# Altium schematic sheet top.SchDoc
size A4; SheetNumber: 1; SheetTotal: 3
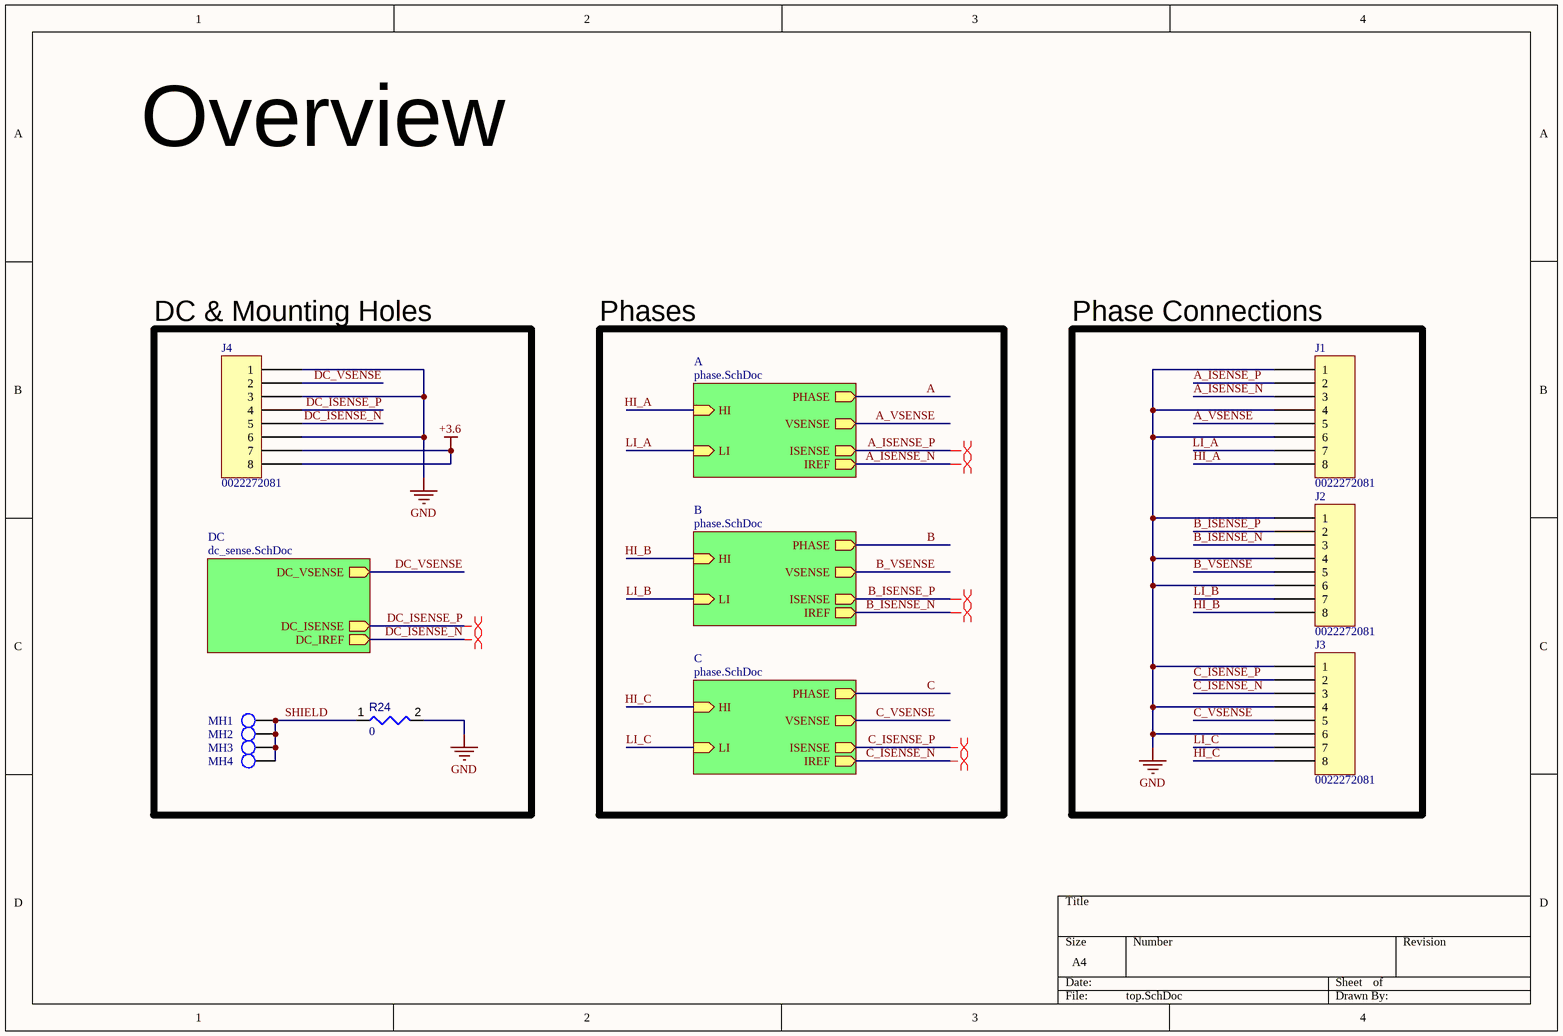
[diagram p0: top.SchDoc]

## Parts
J1  0022272081  [MOLEX KK 0022272081]
J2  0022272081  [MOLEX KK 0022272081]
J3  0022272081  [MOLEX KK 0022272081]
J4  0022272081  [MOLEX KK 0022272081]
MH1  Mounting Hole M2.5-Plated  [Copy of Mounting Hole 6-32-Footprint-1]  (value not drawn)
MH2  Mounting Hole M2.5-Plated  [Copy of Mounting Hole 6-32-Footprint-1]  (value not drawn)
MH3  Mounting Hole M2.5-Plated  [Copy of Mounting Hole 6-32-Footprint-1]  (value not drawn)
MH4  Mounting Hole M2.5-Plated  [Copy of Mounting Hole 6-32-Footprint-1]  (value not drawn)
R24  value 0  [RESC0603(1608)_L]  (hidden comment: 0R3J)

## Blocks framed on the sheet
DC & Mounting Holes: J4 MH1-MH4 R24
Phase Connections: J1-J3

## Sub-sheets
A = phase.SchDoc: HI (in), LI (in), PHASE (out), VSENSE (out), ISENSE (out), IREF (out)
B = phase.SchDoc: HI (in), LI (in), PHASE (out), VSENSE (out), ISENSE (out), IREF (out)
C = phase.SchDoc: HI (in), LI (in), PHASE (out), VSENSE (out), ISENSE (out), IREF (out)
DC = dc_sense.SchDoc: DC_VSENSE (out), DC_ISENSE (out), DC_IREF (out)

## Nets
+3.6: J4.7 J4.8
GND: J1.1 J1.4 J1.6 J2.1 J2.4 J2.6 J3.1 J3.4 J3.6 J4.1 J4.3 J4.6 R24.2
A: sheet A/PHASE
A_ISENSE_N: J1.3 ; sheet A/IREF
A_ISENSE_P: J1.2 ; sheet A/ISENSE
A_VSENSE: J1.5 ; sheet A/VSENSE
B: sheet B/PHASE
B_ISENSE_N: J2.3 ; sheet B/IREF
B_ISENSE_P: J2.2 ; sheet B/ISENSE
B_VSENSE: J2.5 ; sheet B/VSENSE
C: sheet C/PHASE
C_ISENSE_N: J3.3 ; sheet C/IREF
C_ISENSE_P: J3.2 ; sheet C/ISENSE
C_VSENSE: J3.5 ; sheet C/VSENSE
DC_ISENSE_N: J4.5 ; sheet DC/DC_IREF
DC_ISENSE_P: J4.4 ; sheet DC/DC_ISENSE
DC_VSENSE: J4.2 ; sheet DC/DC_VSENSE
HI_A: J1.8 ; sheet A/HI
HI_B: J2.8 ; sheet B/HI
HI_C: J3.8 ; sheet C/HI
LI_A: J1.7 ; sheet A/LI
LI_B: J2.7 ; sheet B/LI
LI_C: J3.7 ; sheet C/LI
SHIELD: MH1.1 MH2.1 MH3.1 MH4.1 R24.1

## Layout directives
differential pair: A_ISENSE_N, A_ISENSE_P, B_ISENSE_N, B_ISENSE_P, C_ISENSE_N, C_ISENSE_P, DC_ISENSE_N, DC_ISENSE_P

## Notes on the sheet
- Overview
- Phases

## Library data of the parts
J1-J4 = CMP-002-00675-1: CONN HEADER VERT 8POS 2.54MM; Manufacturer: Molex; Contact Length - Mating: 0.295" (7.49mm); Contact Length - Post: 0.140" (3.56mm); Shrouding: Shrouded - 1 Wall; Style: Board to Cable/Wire; Number of Positions Loaded: All; Number of Positions: 8; Pitch - Mating: 0.100" (2.54mm); Overall Contact Length: 0.560" (14.22mm); Material Flammability Rating: UL94 V-0; Insulation Height: 0.461" (11.70mm); LastUpdated: 1/12/2020 11:52:41 PM; Connector Type: Header; ComponentLink2Description: DigiKey Link; ComponentLink2URL: http://digikey.com/product-detail/en/molex/0022272081/WM4117-ND/1130583; Part Number: 0022272081; Part Status: Active; ComponentLink1Description: Datasheet; Lifecycle Status: Active; PartId: 82; Contact Finish Thickness - Mating: 100.0µin (2.54µm); Number of Rows: 1; Series: KK 6410; Termination: Solder; Fastening Type: Friction Lock; Insulation Material: Polyamide (PA), Nylon; Contact Shape: Square; Minimum Order: 1; Packaging: Bulk; Price: 0.60; Insulation Color: Natural; Contact Type: Male Pin; Contact Material: Brass; Mounting Type: Through Hole; ComponentLink1URL: https://www.molex.com/pdm_docs/sd/022272081_sd.pdf; Contact Finish - Mating: Tin; Contact Finish - Post: Tin
MH1-MH4 = CMP-00028-00010-2
R24 = CMP-009-00063-2: Jumper 0603 (1608 Metric); Case/Package: 0603; Mounting Technology: SMT; Pins: 2